# EAGLE design pi-crust (EAGLE 6.4)
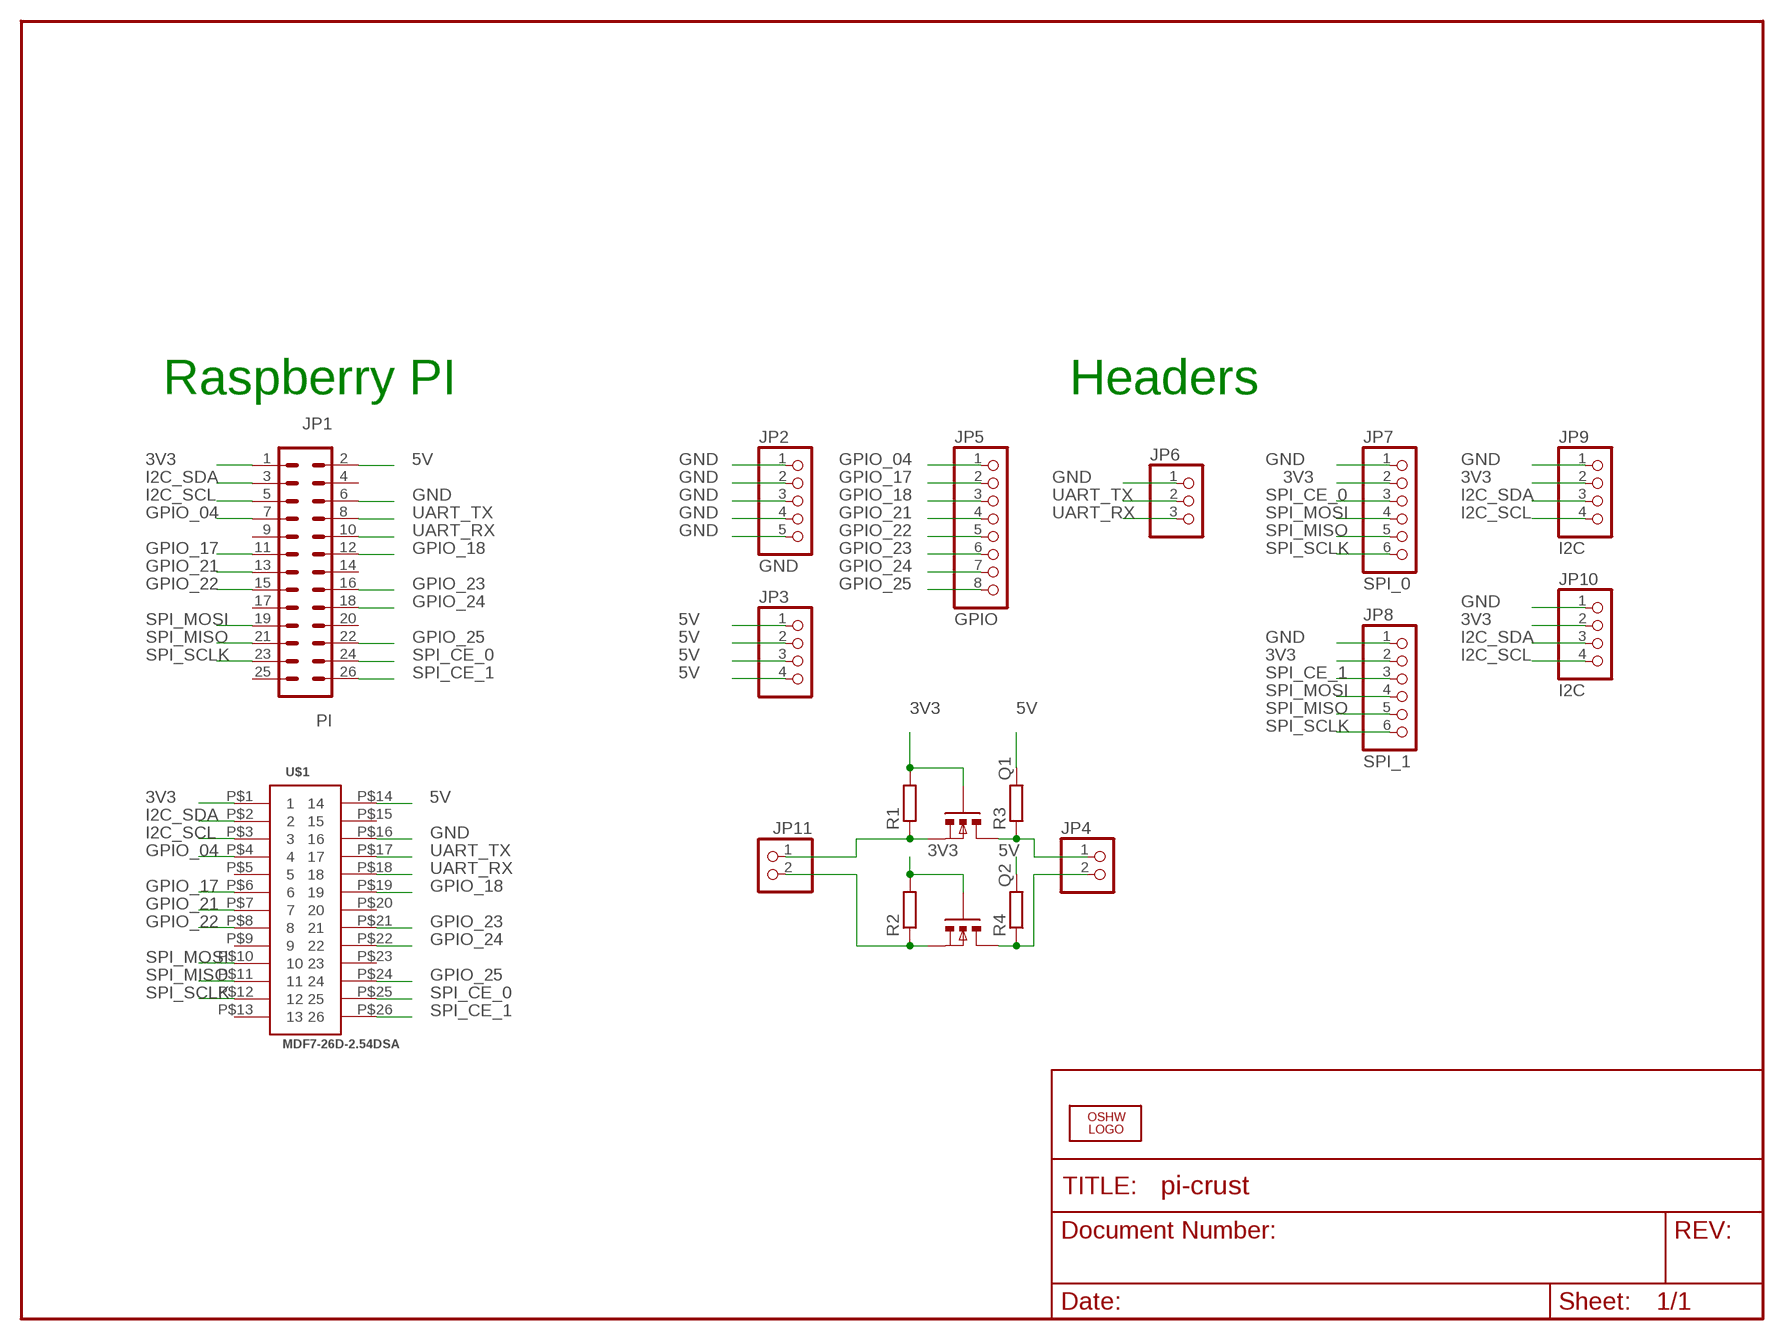
[diagram p0: schematic, sheet 1]

## Parts
JP1  PI  MA13-2  [MA13-2]
JP2  GND  PINHD-1X5  [1X05]
JP3  PINHD-1X4  [1X04]
JP4  PINHD-1X2  [1X02]
JP5  GPIO  PINHD-1X8  [1X08]
JP6  PINHD-1X3  [1X03]
JP7  SPI_0  PINHD-1X6  [1X06]
JP8  SPI_1  PINHD-1X6  [1X06]
JP9  I2C  PINHD-1X4  [1X04]
JP10  I2C  PINHD-1X4  [1X04]
JP11  PINHD-1X2  [1X02]
LOGO1  OSHW_LOGO_8MILX0100-NT  [OSHW_8X100_NOTEXT]
Q1  BSS138SMD  [SOT23]
Q2  BSS138SMD  [SOT23]
R1  R-EU_R0603  [R0603]
R2  R-EU_R0603  [R0603]
R3  R-EU_R0603  [R0603]
R4  R-EU_R0603  [R0603]
U$1  MDF7-26D-2.54DSA  [MDF7-26D-2.54DSA]

## Nets
3V3: JP1.1 JP7.2 JP8.2 JP9.2 JP10.2 Q1.2(G) Q2.2(G) R1.2 R2.2 U$1.P$1
5V: JP1.2 JP3.1 JP3.2 JP3.3 JP3.4 R3.2 R4.2 U$1.P$14
GND: JP1.6 JP2.1 JP2.2 JP2.3 JP2.4 JP2.5 JP6.1 JP7.1 JP8.1 JP9.1 JP10.1 U$1.P$16
GPIO_04: JP1.7 JP5.1 U$1.P$4
GPIO_17: JP1.11 JP5.2 U$1.P$6
GPIO_18: JP1.12 JP5.3 U$1.P$19
GPIO_21: JP1.13 JP5.4 U$1.P$7
GPIO_22: JP1.15 JP5.5 U$1.P$8
GPIO_23: JP1.16 JP5.6 U$1.P$21
GPIO_24: JP1.18 JP5.7 U$1.P$22
GPIO_25: JP1.22 JP5.8 U$1.P$24
I2C_SCL: JP1.5 JP9.4 JP10.4 U$1.P$3
I2C_SDA: JP1.3 JP9.3 JP10.3 U$1.P$2
N$1: JP11.2 Q2.1(S) R2.1
N$2: JP4.2 Q2.3(D) R4.1
N$3: JP11.1 Q1.1(S) R1.1
N$4: JP4.1 Q1.3(D) R3.1
SPI_CE_0: JP1.24 JP7.3 U$1.P$25
SPI_CE_1: JP1.26 JP8.3 U$1.P$26
SPI_MISO: JP1.21 JP7.5 JP8.5 U$1.P$11
SPI_MOSI: JP1.19 JP7.4 JP8.4 U$1.P$10
SPI_SCLK: JP1.23 JP7.6 JP8.6 U$1.P$12
UART_RX: JP1.10 JP6.3 U$1.P$18
UART_TX: JP1.8 JP6.2 U$1.P$17
Unconnected: JP1.4 JP1.9 JP1.14 JP1.17 JP1.20 JP1.25 U$1.P$5 U$1.P$9 U$1.P$13 U$1.P$15 U$1.P$20 U$1.P$23

## Notes on the sheet
- Raspberry PI | Headers

## Library data of the parts
JP1 = pi-crust:MA13-2: PIN HEADER; OC_FARNELL: unknown; OC_NEWARK: unknown
JP2 = pinhead:PINHD-1X5: PIN HEADER
JP3 JP9 JP10 = pinhead:PINHD-1X4: PIN HEADER
JP4 JP11 = pinhead:PINHD-1X2: PIN HEADER
JP5 = pinhead:PINHD-1X8: PIN HEADER
JP6 = pinhead:PINHD-1X3: PIN HEADER
JP7 JP8 = pinhead:PINHD-1X6: PIN HEADER
LOGO1 = ohw-logo:OSHW_LOGO_8MIL
Q1 Q2 = #_GM99:BSS138SMD
R1-R4 = rcl:R-EU_: RESISTOR, European symbol
U$1 = E-test-solutions (5):MDF7-26D-2.54DSA

## Board
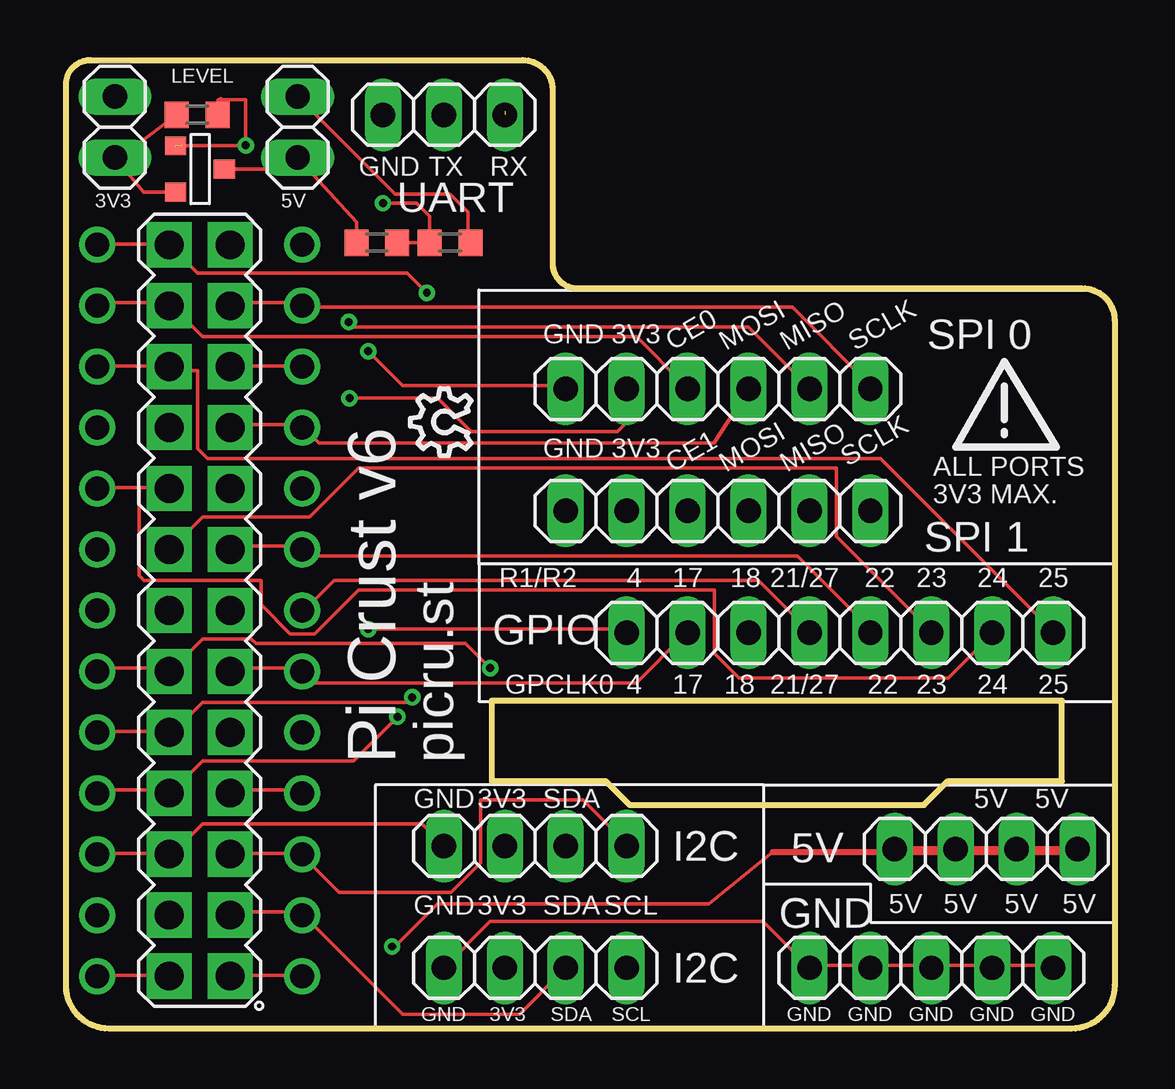
[diagram p1: board, top side]
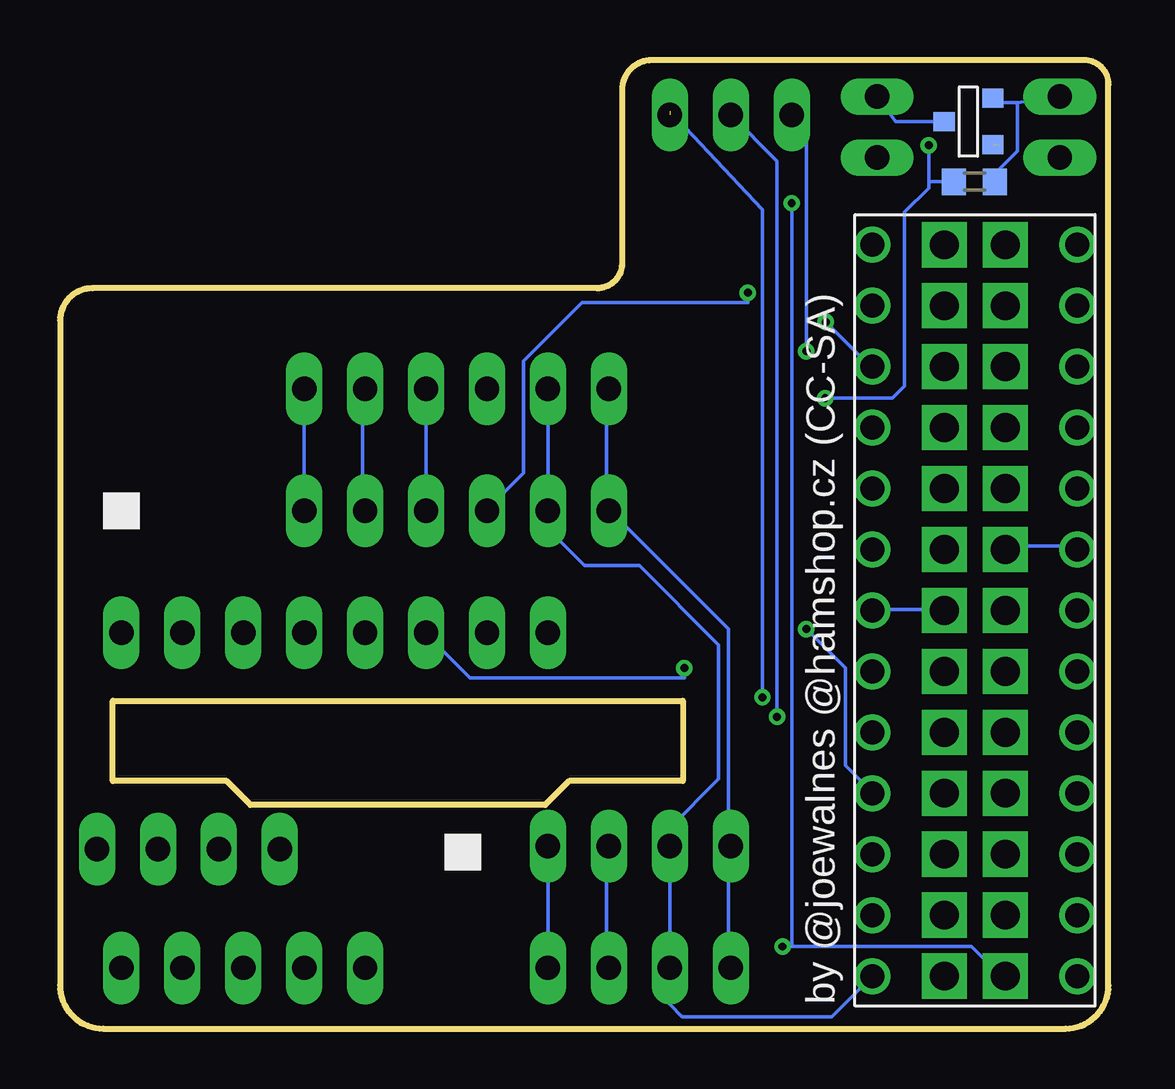
[diagram p2: board, bottom side, seen from below]

Size 43.71 x 40.37 mm. Coordinates in mm from the lower left corner, seen from the top.
Outline: 17.74,10.33 17.74,13.67
Outline: 17.74,10.33 17.74,13.66 41.51,13.66 41.51,10.32 36.76,10.32 35.76,9.32 23.49,9.32 22.49,10.32 17.74,10.32 17.74,10.33
Outline: 0,39.36 arc-90 1.01,40.37 19.04,40.37 arc-90 20.28,39.13 20.28,31.9 arc90 21.32,30.86 42.36,30.86 arc-90 43.71,29.51 43.71,1.8 arc-90 41.91,0 1.79,0 arc-90 0,1.79 0,39.36
Copper layers (1*16): Top 0.0356mm / dielectric 1.5011mm / Bottom 0.0356mm
Design rules "default": minimum track width 6mil, minimum drill 13mil, track to track 6mil, track to pad 6mil, pad to pad 6mil, via to via 6mil, smd to smd 6mil, copper to edge 15mil, drill to drill 6mil, minimum pad ring 7mil, minimum via ring 7mil, stop-mask expansion 4mil, vias tented up to drill 20mil, thermal gap 10mil
bKeepout: area 7.8,4.5 to 13.9,15; area 35.7,23.4 to 43.3,27.7; area 29.5,7 to 33,9.3; area 25.1,1.1 to 27.9,5.2; area 10.3,17 to 16.2,36.2

### Footprints (pad centres in the part's own frame; a part is rotated, then mirrored left to right if it is on the bottom)
MA13-2 = drill 1.2 pad 1.88 square: 1 -15.24,-1.27; 2 -15.24,1.27; 3 -12.7,-1.27; 4 -12.7,1.27; 5 -10.16,-1.27; 6 -10.16,1.27; 7 -7.62,-1.27; 8 -7.62,1.27; 9 -5.08,-1.27; 10 -5.08,1.27; 11 -2.54,-1.27; 12 -2.54,1.27; 13 0,-1.27; 14 0,1.27; 15 2.54,-1.27; 16 2.54,1.27; 17 5.08,-1.27; 18 5.08,1.27; 19 7.62,-1.27; 20 7.62,1.27; 21 10.16,-1.27; 22 10.16,1.27; 23 12.7,-1.27; 24 12.7,1.27; 25 15.24,-1.27; 26 15.24,1.27
1X05 = drill 1.016 long: 1 -5.08,0; 2 -2.54,0; 3 0,0; 4 2.54,0; 5 5.08,0
1X04 = drill 1.016 long: 1 -3.81,0; 2 -1.27,0; 3 1.27,0; 4 3.81,0
1X02 = drill 1.016 long: 1 -1.27,0; 2 1.27,0
1X08 = drill 1.016 long: 1 -8.89,0; 2 -6.35,0; 3 -3.81,0; 4 -1.27,0; 5 1.27,0; 6 3.81,0; 7 6.35,0; 8 8.89,0
1X03 = drill 1.016 long: 1 -2.54,0; 2 0,0; 3 2.54,0
1X06 = drill 1.016 long: 1 -6.35,0; 2 -3.81,0; 3 -1.27,0; 4 1.27,0; 5 3.81,0; 6 6.35,0
SOT23 = smd 0.787 x 0.889: 1 -0.94,1.016; 2 0.991,1.016; 3 0.025,-1.016
R0603 = smd 1 x 1.1: 1 -0.85,0; 2 0.85,0
MDF7-26D-2.54DSA = drill 1: P$1 -15.25,4.27; P$2 -12.71,4.27; P$3 -10.17,4.27; P$4 -7.63,4.27; P$5 -5.09,4.27; P$6 -2.55,4.27; P$7 -0.01,4.27; P$8 2.53,4.27; P$9 5.07,4.27; P$10 7.61,4.27; P$11 10.15,4.27; P$12 12.69,4.27; P$13 15.23,4.27; P$14 -15.25,-4.27; P$15 -12.71,-4.27; P$16 -10.17,-4.27; P$17 -7.63,-4.27; P$18 -5.09,-4.27; P$19 -2.55,-4.27; P$20 -0.01,-4.27; P$21 2.53,-4.27; P$22 5.07,-4.27; P$23 7.61,-4.27; P$24 10.15,-4.27; P$25 12.69,-4.27; P$26 15.23,-4.27

### Placement (x,y rotation side)
JP1  5.57,17.43 90 top
JP2  36.07,2.53 0 top
JP3  38.35,7.48 0 top
JP4  9.65,37.58 270 top
JP5  32.26,16.5 0 top
JP6  15.75,38.09 0 top
JP7  27.18,26.66 0 top
JP8  27.18,21.58 0 top
JP9  19.56,7.61 0 top
JP10  19.56,2.53 0 top
JP11  2.03,37.58 270 top
LOGO1  16.89,23.87 90 top
Q1  5.84,37.84 270 bottom
Q2  5.59,35.8 90 top
R1  5.59,35.3 180 bottom
R2  5.46,38.09 0 top
R3  16,32.76 180 top
R4  12.95,32.76 0 top
U$1  5.57,17.44 90 bottom

### Tracks (layer width: path | path; a pad name or v marks a point on that pad's centre or on a via)
3V3  (via drill 0.33)  (1 unrouted)
  Top 0.152: U$1.P$1 9.75,2.23 6.91,2.23 JP1.1 | R2.2 6.35,38.73 | JP8.2 23.62,21.58 | v7.49,36.82 7.49,38.73 6.44,38.73 | Q2.2 7.49,36.8 | v11.81,26.28 15.49,26.28 16.89,24.88 22.99,24.88 23.37,25.26 JP7.2
  Top 0.229: 6.44,38.73 R2.2 | 7.49,36.8 v7.49,36.82
  Bottom 0.152: 6.71,2.23 JP1.1 | 23.37,22.34 JP7.2 23.37,27.93 | U$1.P$1 11.53,0.5 17.78,0.5 18.29,1.01 JP10.2 JP9.2 18.29,8.37 16.26,10.4 16.26,15.99 19.56,19.29 21.84,19.29 23.37,20.82 JP8.2 | R1.2 7.49,35.3 | 7.49,35.3 v7.49,36.82 | 7.49,35.3 7.49,35.04 8.51,34.03 8.51,26.79 9.02,26.28 v11.81,26.28
  Bottom 0.406: 23.37,22.34 JP8.2
5V  (via drill 0.33)
  Top 0.152: U$1.P$14 1.42,2.23 4.27,2.23 JP1.2 | R4.2 R3.2 15.15,33.86 14.61,34.41 v13.21,34.41 | v13.59,3.42 13.72,3.42 15.49,5.2 26.8,5.2 29.46,7.36
  Top 0.254: 29.46,7.36 40.13,7.36 | 40.13,7.36 42.42,7.36 | JP3.1 JP3.2 JP3.3 | JP3.3 40.13,7.48 40.13,7.36 | JP3.3 JP3.4
  Bottom 0.152: JP1.2 4.49,2.19 5.71,3.42 13.21,3.42 | 13.21,3.42 v13.59,3.42 | v13.21,34.41 13.21,3.42
GND  (via drill 0.33)
  Top 0.152: v12.6,28.23 14.02,26.81 20.73,26.81 JP7.1 | 33.53,2.63 31.09,2.63 JP2.1 29.06,4.46 17.68,4.46 JP10.1 | 38.61,2.63 36.17,2.63 JP2.3 35.97,2.63 33.53,2.63 | 38.61,2.63 41.05,2.63 JP2.5 | 38.61,2.63 JP2.4 | 33.53,2.63 JP2.2 | U$1.P$16 1.42,7.31 4.27,7.31 JP1.6 4.47,7.31 5.69,8.52 14.83,8.52 JP9.1
  Bottom 0.152: JP7.1 20.93,26.61 20.93,21.73 JP8.1 20.73,21.53 15.85,16.65 15.85,7.71 JP9.1 15.85,7.51 15.85,2.63 JP10.1 | v12.6,28.23 12.6,37.48 JP6.1
GPIO_04  (via drill 0.33)
  Top 0.152: U$1.P$4 9.75,9.95 6.91,9.95 JP1.7 | v12.6,16.65 23.37,16.65 JP5.1
  Bottom 0.152: v12.6,16.65 10.97,15.03 10.97,10.96 9.96,9.95 U$1.P$4
GPIO_17
  Top 0.152: JP1.11 6.91,15.03 9.75,15.03 U$1.P$6 9.96,14.82 10.36,14.42 23.77,14.42 25.81,16.45 JP5.2
GPIO_18  (via drill 0.33)
  Top 0.152: U$1.P$19 1.42,15.03 4.27,15.03 JP1.12 4.47,15.03 5.69,16.25 7.72,16.25 7.93,16.04 16.66,16.04 v17.68,15.03
  Bottom 0.152: v17.68,15.03 17.68,14.62 26.62,14.62 28.45,16.45 JP5.3
GPIO_21
  Top 0.152: JP5.4 30.89,16.65 28.85,18.68 11.18,18.68 9.96,17.46 U$1.P$7
  Bottom 0.152: U$1.P$7 9.75,17.46 6.91,17.46 JP1.13
GPIO_22
  Top 0.152: JP1.15 6.91,20.11 9.75,20.11 U$1.P$8 9.96,19.9 10.16,19.7 30.48,19.7 33.53,16.65 JP5.5
GPIO_23
  Top 0.152: JP5.6 35.97,16.65 32.11,20.51 32.11,23.36 12.19,23.36 10.16,21.33 5.69,21.33 4.47,20.11 JP1.16
  Bottom 0.152: U$1.P$21 1.42,20.11 4.27,20.11 JP1.16
GPIO_24
  Top 0.152: 3.05,22.54 4.27,22.54 JP1.18 | 3.05,22.54 1.42,22.54 U$1.P$22 | 3.05,22.54 3.05,18.89 3.25,18.68 8.13,18.68 8.13,17.67 9.35,16.45 10.36,16.45 12.19,18.28 27.03,18.28 27.03,15.64 28.04,14.62 36.78,14.62 38.61,16.45 JP5.7
GPIO_25
  Top 0.152: U$1.P$24 1.42,27.62 4.27,27.62 JP1.22 4.47,27.42 5.49,27.42 5.49,24.17 5.89,23.76 33.93,23.76 41.05,16.65 JP5.8
I2C_SCL
  Top 0.152: JP1.5 6.91,7.31 9.75,7.31 U$1.P$3 9.96,7.1 11.38,5.68 16.05,5.68 17.27,6.9 17.27,9.54 21.54,9.54 23.37,7.71 JP9.4
  Bottom 0.152: JP9.4 JP10.4
I2C_SDA
  Top 0.152: JP1.3 6.91,4.87 9.75,4.87 U$1.P$2 9.96,4.66 14.02,0.6 18.9,0.6 JP10.3
  Bottom 0.152: JP10.3 20.93,2.63 20.93,7.51 JP9.3
N$1
  Top 0.152: R2.1 2.03,36.15 JP11.2 3.23,34.86 Q2.1
N$2
  Top 0.152: Q2.3 9.42,35.83 JP4.2 12.1,33.61 R4.1
N$3
  Bottom 0.152: JP11.1 3.81,38.6 | 3.81,38.6 4.65,38.6 Q1.1 | R1.1 4.74,35.64 3.81,36.57 3.81,38.6
N$4
  Top 0.152: JP4.1 13.72,34.79 16,34.79 16.76,34.03 16.76,32.84 R3.1
  Bottom 0.152: Q1.3 8.87,37.81 JP4.1
SPI_CE_0
  Top 0.152: U$1.P$25 1.42,30.27 4.27,30.27 JP1.24 4.47,30.06 5.69,28.84 23.77,28.84 25.81,26.81 JP7.3
SPI_CE_1  (via drill 0.33)
  Top 0.152: U$1.P$26 1.42,32.71 4.27,32.71 JP1.26 4.47,32.5 5.49,31.49 14.22,31.49 v15.04,30.67
  Bottom 0.152: v15.04,30.67 15.04,30.27 21.95,30.27 24.38,27.83 24.38,23.15 25.81,21.73 JP8.3
SPI_MISO  (via drill 0.33)
  Top 0.152: U$1.P$11 9.75,27.62 6.91,27.62 JP1.21 | v11.79,29.45 11.99,29.25 28.45,29.25 30.89,26.81 JP7.5
  Bottom 0.152: JP8.5 31.09,21.73 31.09,26.61 JP7.5 | v11.79,29.45 9.96,27.62 U$1.P$11
SPI_MOSI
  Top 0.152: JP1.19 6.91,25.19 9.75,25.19 U$1.P$10 9.96,24.98 10.54,24.4 27,24.4 28.45,26.61 JP7.4
  Bottom 0.152: JP7.4 JP8.4
SPI_SCLK
  Top 0.152: JP1.23 6.91,30.27 9.75,30.27 U$1.P$12 9.96,30.06 30.28,30.06 33.53,26.81 JP7.6
  Bottom 0.152: JP7.6 JP8.6
UART_RX  (via drill 0.33)  (1 unrouted)
  Top 0.152: U$1.P$18 1.42,12.38 4.27,12.38 JP1.10 4.47,12.38 5.69,13.6 14.22,13.6 v14.43,13.81
  Bottom 0.152: 18.29,38.24 14.43,34.13 v14.43,13.81
UART_TX  (via drill 0.33)
  Top 0.152: U$1.P$17 1.42,9.95 4.27,9.95 JP1.8 4.47,9.95 5.69,11.17 11.99,11.17 v13.82,13
  Bottom 0.152: v13.82,13 13.82,36.16 JP6.2

### Text on the board
tNames: LEVEL | GND | TX | RX | 3V3 | 5V | UART | GND | 3V3 | CE0 | MOSI | MISO | SCLK | SPI 0 | GND | 3V3 | CE1 | MOSI | MISO | SCLK | ALL PORTS | 3V3 MAX. | SPI 1 | R1/R2 | 4 | 17 | 18 | 21/27 | 22 | 23 | 24 | 25 | GPCLK0 | 4 | 17 | 18 | 21/27 | 22 | 23 | 24 | 25 | Pi Crust v6 | picru.st | GND | 3V3 | SDA | 5V | 5V | 5V | GND | 3V3 | SDA | SCL | 5V | 5V | 5V | 5V | GND | 3V3 | SDA | SCL | GND | GND | GND | GND | GND
bNames: by @joewalnes @hamshop.cz (CC-SA)